# EAGLE design CSR8645-VFBGA275um-V3 (EAGLE 7.2.0)
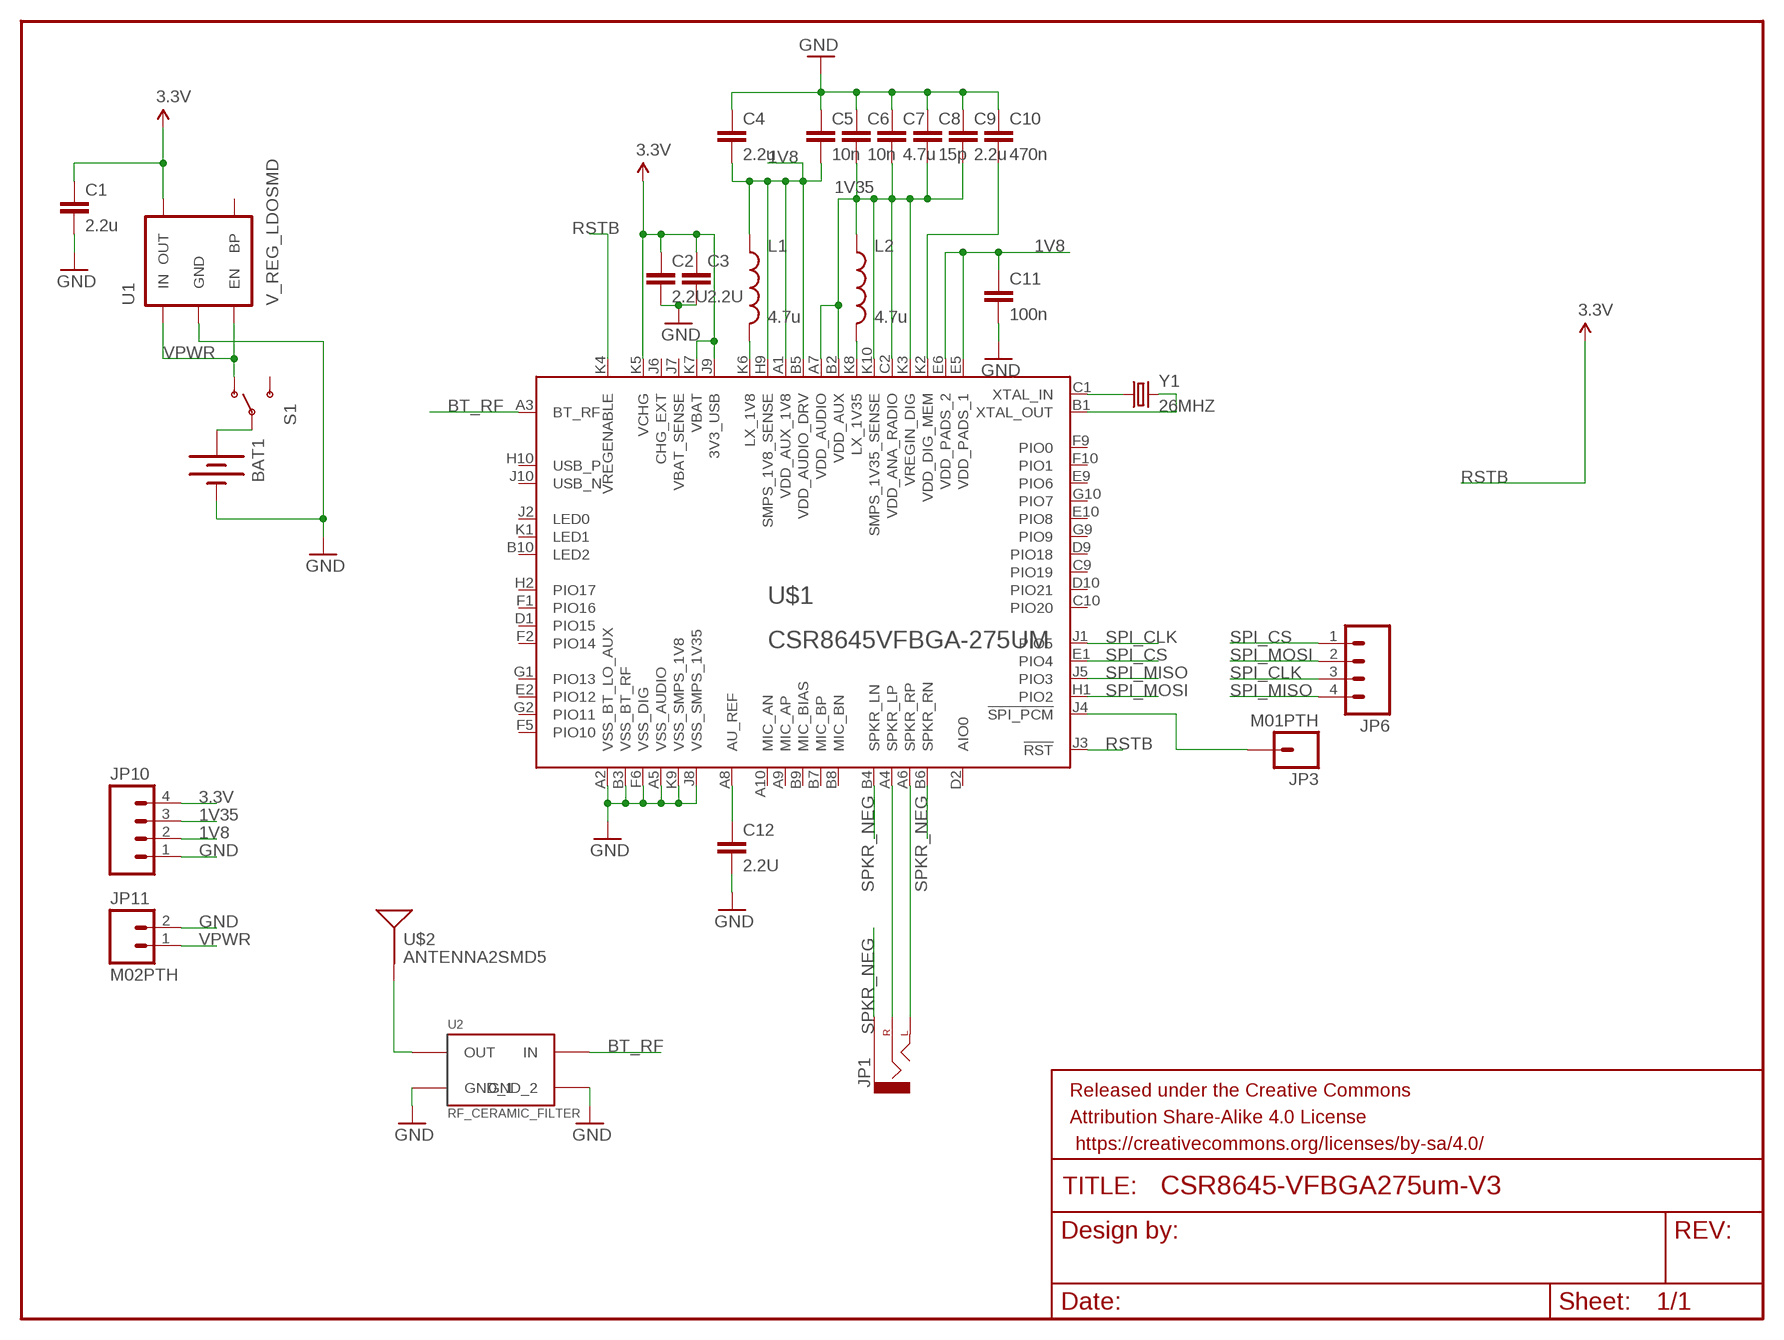
[diagram p0: schematic, sheet 1]

## Parts
BAT1  BATTERY9V  [BATTCON_9V]
C1  2.2u  CAP0603-CAP  [0603-CAP]
C2  2.2U  CAP0603-CAP  [0603-CAP]
C3  2.2U  CAP0603-CAP  [0603-CAP]
C4  2.2u  CAP0603-CAP  [0603-CAP]
C5  10n  CAP0603-CAP  [0603-CAP]
C6  10n  CAP0603-CAP  [0603-CAP]
C7  4.7u  CAP0603-CAP  [0603-CAP]
C8  15p  CAP0603-CAP  [0603-CAP]
C9  2.2u  CAP0603-CAP  [0603-CAP]
C10  470n  CAP0603-CAP  [0603-CAP]
C11  100n  CAP0603-CAP  [0603-CAP]
C12  2.2U  CAP0603-CAP  [0603-CAP]
FRAME1  FRAME-LETTER  [CREATIVE_COMMONS]
JP1  AUDIO-JACKSMD2  [AUDIO-JACK-3.5MM-SMD]
JP3  M01PTH  [1X01]
JP6  M04PTH  [1X04]
JP10  M04PTH  [1X04]
JP11  M02PTH  [1X02]
L1  4.7u  INDUCTOR0805  [0805]
L2  4.7u  INDUCTOR0805  [0805]
S1  SWITCH-SPDTPTH  [SWITCH-SPDT]
U1  V_REG_LDOSMD  [SOT23-5]
U2  RF_CERAMIC_FILTER  [RF_FILTER]
U$1  CSR8645VFBGA-275UM  [VFBGA68-LARGE]
U$2  ANTENNA2SMD5  [ANTENNA-CHIP5]
Y1  26MHZ  CRYSTALHC49US  [HC49US]

## Nets
1V8: C4.2 C5.2 C11.1 JP10.2 L1.1 U$1.A1(VDD_AUX_1V8) U$1.B5(VDD_AUDIO_DRV) U$1.E5(VDD_PADS_1) U$1.E6(VDD_PADS_2) U$1.H9(SMPS_1V8_SENSE)
1V35: C6.2 C7.2 C8.2 C9.2 JP10.3 L2.1 U$1.A7(VDD_AUDIO) U$1.B2(VDD_AUX) U$1.C2(VDD_ANA_RADIO) U$1.K3(VREGIN_DIG) U$1.K10(SMPS_1V35_SENSE)
3.3V: C1.1 C2.1 C3.1 JP10.4 U1.5(OUT) U$1.J9(3V3_USB) U$1.K5(VCHG) U$1.K7(VBAT)
!SPI_PCM: JP3.1 U$1.J4(!SPI_PCM)
BT_RF: U2.3(IN) U$1.A3(BT_RF)
GND: BAT1.- C1.2 C2.2 C3.2 C4.1 C5.1 C6.1 C7.1 C8.1 C9.1 C10.1 C11.2 C12.2 JP10.1 JP11.2 U1.2(GND) U2.2(GND_1) U2.4(GND_2) U$1.A2(VSS_BT_LO_AUX) U$1.A5(VSS_AUDIO) U$1.B3(VSS_BT_RF) U$1.F6(VSS_DIG) U$1.J8(VSS_SMPS_1V35) U$1.K9(VSS_SMPS_1V8)
N$1: BAT1.+ S1.2(P)
N$2: JP1.RING(RIGHT) U$1.A4(SPKR_LP)
N$3: L1.2 U$1.K6(LX_1V8)
N$4: L2.2 U$1.K8(LX_1V35)
N$5: U$1.C1(XTAL_IN) Y1.1
N$6: C10.2 U$1.K2(VDD_DIG_MEM)
N$7: U$1.B1(XTAL_OUT) Y1.2
N$8: JP1.TIP(LEFT) U$1.A6(SPKR_RP)
N$13: U2.1(OUT) U$2.FEED(SIGNAL)
N$15: C12.1 U$1.A8(AU_REF)
RSTB: U$1.J3(!RST) U$1.K4(VREGENABLE) ; supply symbol labelled 3.3V
SPI_CLK: JP6.3 U$1.J1(PIO5)
SPI_CS: JP6.1 U$1.E1(PIO4)
SPI_MISO: JP6.4 U$1.J5(PIO3)
SPI_MOSI: JP6.2 U$1.H1(PIO2)
SPKR_NEG: JP1.SLEEVE U$1.B4(SPKR_LN) U$1.B6(SPKR_RN)
VPWR: JP11.1 S1.1(O) U1.1(IN) U1.3(EN)
Unconnected: S1.3(S) U1.4(BP) U$1.A9(MIC_AP) U$1.A10(MIC_AN) U$1.B7(MIC_BP) U$1.B8(MIC_BN) U$1.B9(MIC_BIAS) U$1.B10(LED2) U$1.C9(PIO19) U$1.C10(PIO20) U$1.D1(PIO15) U$1.D2(AIO0) U$1.D9(PIO18) U$1.D10(PIO21) U$1.E2(PIO12) U$1.E9(PIO6) U$1.E10(PIO8) U$1.F1(PIO16) U$1.F2(PIO14) U$1.F5(PIO10) U$1.F9(PIO0) U$1.F10(PIO1) U$1.G1(PIO13) U$1.G2(PIO11) U$1.G9(PIO9) U$1.G10(PIO7) U$1.H2(PIO17) U$1.H10(USB_P) U$1.J2(LED0) U$1.J6(CHG_EXT) U$1.J7(VBAT_SENSE) U$1.J10(USB_N) U$1.K1(LED1)

## Library data of the parts
BAT1 = SparkFun-Electromechanical:BATTERY: Battery Holders Various common sizes : AA, AAA, 18650 (PRT-12895), 20mm coin cell and 12mm coin cell. 20MM_4LEGS, BATT-10373
C1-C12 = SparkFun-Passives:CAP: Capacitor Standard 0603 ceramic capacitor, and 0.1" leaded capacitor.
FRAME1 = SparkFun-Aesthetics:FRAME-LETTER: Schematic Frame Standard 8.5x11 US Letter frame
JP1 = SparkFun-Connectors:AUDIO-JACK: 3.5mm Audio Jack Simple 3.5mm common PCB mount audio jack. SKU: PRT-08032; PROD_ID: CONN-10353
JP3 = SparkFun-Connectors:M01: Header 1 Standard 1-pin 0.1" header. Use with straight break away headers (SKU : PRT-00116), right angle break away headers (PRT-00553), swiss pins (PRT-00743), machine pins (PRT-00117), and female headers (PRT-00115).
JP6 JP10 = SparkFun-Connectors:M04: Header 4 Standard 4-pin 0.1" header. Use with straight break away headers (SKU : PRT-00116), right angle break away headers (PRT-00553), swiss pins (PRT-00743), machine pins (PRT-00117), and female headers (PRT-00115). Molex polarized connector foot print use with SKU : PRT-08231 with associated crimp pins and housings. 1MM SMD Version SKU: PRT-10208
JP11 = SparkFun-Connectors:M02: Standard 2-pin 0.1" header. Use with - straight break away headers ( PRT-00116) - right angle break away headers (PRT-00553) - swiss pins (PRT-00743) - machine pins (PRT-00117) - female headers (PRT-00115) Molex polarized connector foot print use with: PRT-08233 with associated crimp pins and housings. 2.54_SCREWTERM for use with PRT-10571. 3.5mm Screw Terminal footprints for PRT-08084 5mm Screw Terminal footprints for use with PRT-08432
L1 L2 = SparkFun-Passives:INDUCTOR: Inductors Basic Inductor/Choke - 0603 and 1206. Footprints are not proven and vary greatly between part numbers. SRN6045- 33uH, 20% 1.4A SDR0403-560KL - 56uH, 10%, 500mA RMS/740mA peak
S1 = SparkFun-Electromechanical:SWITCH-SPDT: SPDT Switch Simple slide switch, Spark Fun Electronics SKU : COM-00102 DPDT SMT slide switch, AYZ0202, SWCH-08179; PROD_ID: SWCH-08261
U1 = SparkFun-PowerIC:V_REG_LDO: Voltage Regulator LDO Standard 150mA LDO voltage regulator in SOT-23 layout. Micrel part MIC5205. BP (by-pass) pin is used to lower output noise with 470pF cap.
U2 = SparkFun-RF:RF_CERAMIC_FILTER
U$1 = SparkFun-DigitalIC:CSR8645
U$2 = SparkFun-RF:ANTENNA2: Chip antenna Single endded antenna. Common with smaller chip antennas. CHIP4 package is the GPS Chip Antenna SKU: GPS-08418. CHIP5 package is 2.4GHz chip antenna SKU: WRL-00144.
Y1 = SparkFun-FreqCtrl:CRYSTAL: Various standard crystals. Proven footprints.

## Board
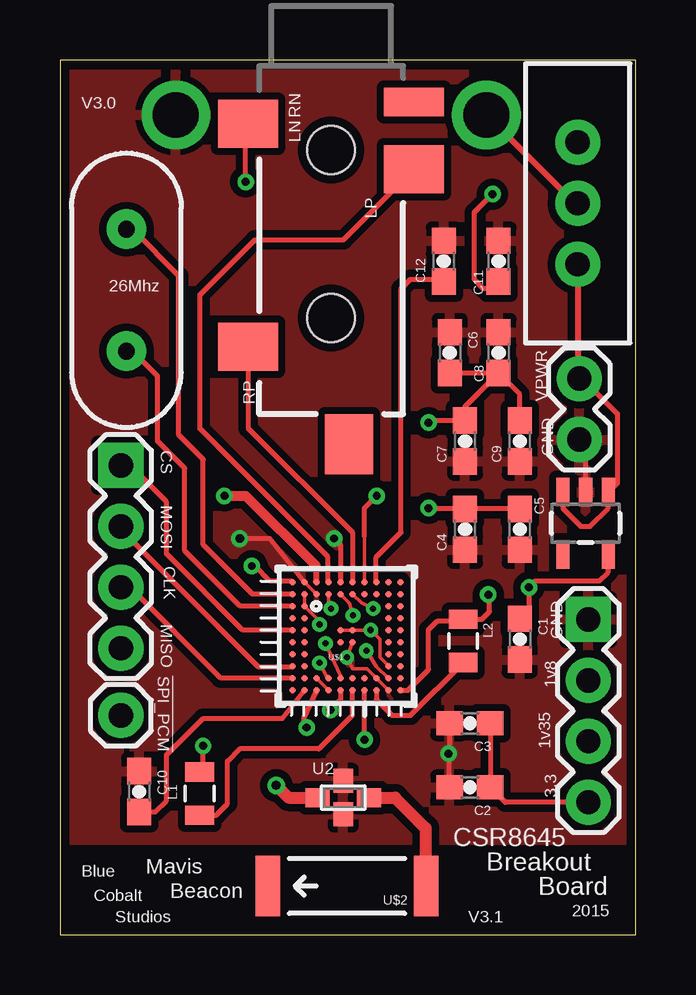
[diagram p1: board, top side]
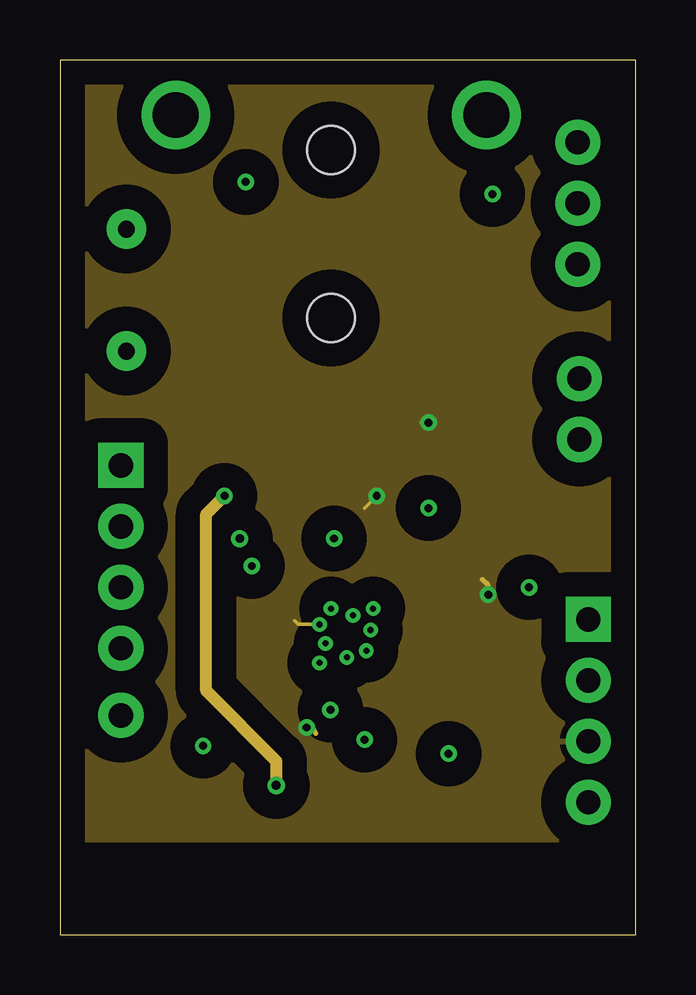
[diagram p2: board, inner layer Route2]
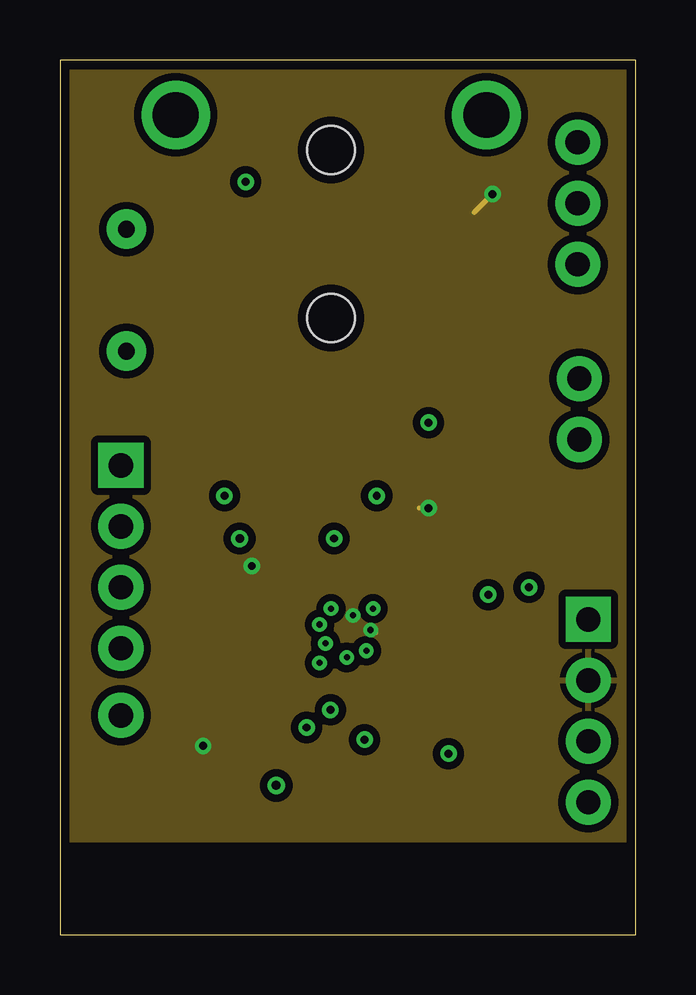
[diagram p3: board, inner layer Route15]
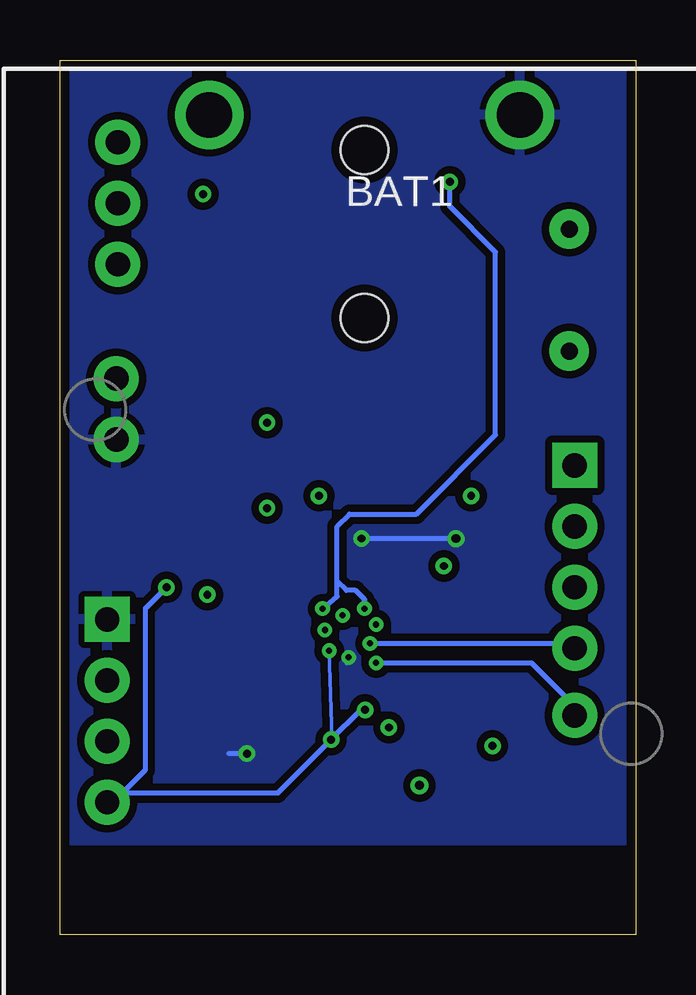
[diagram p4: board, bottom side, seen from below]

Size 24 x 36.45 mm. Coordinates in mm from the lower left corner, seen from the top.
Outline: 0,0 24,0 24,36.45 0,36.45 0,0
Copper layers (1*2*15*16): Top 0.035559375mm / dielectric 0.17018125mm / Route2 0.01778125mm / dielectric 47mil / Route15 0.01778125mm / dielectric 0.17018125mm / Bottom 0.035559375mm
Design rules "OSHPark-4layer *": minimum track width 5mil, minimum drill 10mil, track to track 5mil, track to pad 5mil, pad to pad 5mil, via to via 5mil, smd to smd 5mil, copper to edge 15mil, drill to drill 6mil, minimum pad ring 4mil, minimum via ring 7mil, stop-mask expansion 4mil, vias tented up to drill 20mil, thermal gap 10mil

### Footprints (pad centres in the part's own frame; a part is rotated, then mirrored left to right if it is on the bottom)
BATTCON_9V = drill 1.905: + 0,0; - 0,-12.954
0603-CAP = smd 1.1 x 1: 1 -0.85,0; 2 0.85,0
AUDIO-JACK-3.5MM-SMD = smd 2 x 2.5: RING 4.3,3.45; SLEEVE 2.4,-3.45; TIP 11.7,-3.45 | smd 1.2 x 2.5: RSH 1.5,3.45 | smd 2.5 x 2: TSH 15.75,0.75 | hole 2: 3.5,0; 10.5,0
1X01 = drill 1.016 pad 1.88: 1 0,0
1X04 = drill 1.016 pad 1.88 square: 1 0,0 | drill 1.016 pad 1.88: 2 2.54,0; 3 5.08,0; 4 7.62,0
1X02 = drill 1.016 pad 1.88: 1 0,0; 2 2.54,0
0805 = smd 0.8 x 1.2: 1 -0.9,0; 2 0.9,0
SWITCH-SPDT = drill 1.016 pad 1.88: 1 0,2.54; 2 0,0; 3 0,-2.54
SOT23-5 = smd 0.55 x 1.2: 1 -0.95,-1.3; 2 0,-1.3; 3 0.95,-1.3; 4 0.95,1.3; 5 -0.95,1.3
RF_FILTER = smd 1 x 0.8: 1 1.075,0; 3 -1.075,0 | smd 0.8 x 1: 2 0,0.7; 4 0,-0.7
VFBGA68-LARGE = smd 0.275 x 0.275: A1 -2.25,2.25; A2 -1.75,2.25; A3 -1.25,2.25; A4 -0.75,2.25; A5 -0.25,2.25; A6 0.25,2.25; A7 0.75,2.25; A8 1.25,2.25; A9 1.75,2.25; A10 2.25,2.25; B1 -2.25,1.75; B2 -1.75,1.75; B3 -1.25,1.75; B4 -0.75,1.75; B5 -0.25,1.75; B6 0.25,1.75; B7 0.75,1.75; B8 1.25,1.75; B9 1.75,1.75; B10 2.25,1.75; C1 -2.25,1.25; C2 -1.75,1.25; C9 1.75,1.25; C10 2.25,1.25; D1 -2.25,0.75; D2 -1.75,0.75; D9 1.75,0.75; D10 2.25,0.75; E1 -2.25,0.25; E2 -1.75,0.25; E5 -0.25,0.25; E6 0.25,0.25; E9 1.75,0.25; E10 2.25,0.25; F1 -2.25,-0.25; F2 -1.75,-0.25; F5 -0.25,-0.25; F6 0.25,-0.25; F9 1.75,-0.25; F10 2.25,-0.25; G1 -2.25,-0.75; G2 -1.75,-0.75; G9 1.75,-0.75; G10 2.25,-0.75; H1 -2.25,-1.25; H2 -1.75,-1.25; H9 1.75,-1.25; H10 2.25,-1.25; J1 -2.25,-1.75; J2 -1.75,-1.75; J3 -1.25,-1.75; J4 -0.75,-1.75; J5 -0.25,-1.75; J6 0.25,-1.75; J7 0.75,-1.75; J8 1.25,-1.75; J9 1.75,-1.75; J10 2.25,-1.75; K1 -2.25,-2.25; K2 -1.75,-2.25; K3 -1.25,-2.25; K4 -0.75,-2.25; K5 -0.25,-2.25; K6 0.25,-2.25; K7 0.75,-2.25; K8 1.25,-2.25; K9 1.75,-2.25; K10 2.25,-2.25
ANTENNA-CHIP5 = smd 1.016 x 2.54: FEED -3.302,0; NC 3.302,0
HC49US = drill 0.7 pad 1.651: 1 -2.54,0; 2 2.54,0

### Placement (x,y rotation side)
BAT1  17.78,34.16 90 bottom
C1  19.18,12.32 270 top
C2  17.09,6.15 180 top
C3  17.09,8.81 180 top
C4  16.89,16.89 90 top
C5  19.18,16.89 90 top
C6  16.26,24.26 270 top
C7  16.89,20.57 90 top
C8  18.29,24.26 270 top
C9  19.18,20.57 90 top
C10  3.3,5.97 270 top
C11  18.29,28.07 90 top
C12  16,28.07 90 top
FRAME1  116.59,78.49 0 top  (outside the outline)
JP1  11.3,36.2 270 top
JP3  2.54,9.14 0 top
JP6  2.54,19.56 270 top
JP10  22.03,13.14 270 top
JP11  21.65,23.17 270 top
L1  5.82,5.88 270 top
L2  16.81,12.24 270 top
S1  21.59,30.48 180 top
U1  21.92,17.15 180 top
U2  11.81,5.71 0 top
U$1  11.94,12.45 0 top
U$2  11.97,2.03 180 top
Y1  2.77,26.86 90 top

### Tracks (layer width: path | path; a pad name or v marks a point on that pad's centre or on a via)
1V8  (via drill 0.25, 0.33)
  Top 0.152: U$1.H9 13.34,11.56 13.34,12.32 v12.95,12.7 | U$1.E6 | U$1.E6 U$1.E5 | 13.21,12.57 13.08,12.7 v12.95,12.7 | U$1.E6 v12.95,12.7 | U$1.B5 12.07,13.82 v12.22,13.31
  Top 0.203: v15.37,17.78 15.41,17.74 C4.2 C5.2 | L1.1 5.97,6.93 v5.97,7.87 | U$1.A1 9.65,14.73 8.76,14.73 8.13,15.37 v8,15.37 | C11.1 18.29,27.05 18.16,26.92 17.65,26.92 17.27,27.3 17.27,30.1 v18.03,30.86
  Route15 0.152: v12.95,12.7 13.08,12.7 13.21,12.57
  Route15 0.203: v15.37,17.78 14.99,17.78 | v18.03,30.86 17.27,30.1
  pour Route15 (isolate 0.305): 0,36.45 23.88,36.45 24,3.94 0,3.94
1V35  (via drill 0.25, 0.33)
  Top 0.152: U$1.B2 U$1.C2 | U$1.C2 | U$1.A7 12.69,16.62 | v10.82,12.93 10.82,13.06 U$1.C2
  Top 0.203: C8.2 16.89,22.01 C7.2 15.45,21.42 v15.37,21.34 | U$1.K3 10.16,9.02 10.16,8.64 v10.29,8.64 | U$1.K10 14.53,10.2 14.53,10.21 15.37,11.05 15.37,12.7 15.75,13.08 16.75,13.08 L2.1 17.59,13.14 17.91,13.46 17.91,14.12 v17.86,14.17 | 12.69,16.62 12.69,17.77 v13.21,18.29 | C9.2 19.18,22.52 C8.2 | C8.2 C6.2
  Route2 0.152: v13.21,18.29 12.7,17.78 | v10.82,12.93 9.93,12.93 9.78,13.08
  Route2 0.203: v15.37,21.34 15.11,21.34 | v10.29,8.64 10.54,8.64 10.67,8.38 | v17.86,14.17 17.86,14.55 17.6,14.81
  pour Route2 (isolate 1.016): 0,36.45 23.88,36.45 23.88,3.94 0,3.94
3.3V  (via drill 0.25, 0.33)
  Top 0.152: U$1.J9 13.21,11.18 v12.78,11.84
  Top 0.203: 17.94,8.52 18.24,8.81 C3.1 17.94,8.52 | 17.94,8.52 C2.1 18.57,5.52 JP10.4 | v12.7,8.13 12.7,10.18 U$1.K7 | U$1.K5 11.69,9.78 v11.28,9.37 | U1.5 22.86,15.83 22.86,15.11 22.48,14.73 19.81,14.73 v19.56,14.48 19.56,13.55 C1.1
  Bottom 0.152: 12.65,8.18 v12.78,11.84
  Bottom 0.203: v11.28,9.37 11.56,9.27 12.65,8.18 v12.7,8.13 14.93,5.9 21.4,5.9 | JP10.4 21.65,5.9 21.4,5.9 | 21.4,5.9 20.45,6.86 20.45,13.59 v19.56,14.48
!SPI_PCM  (via drill 0.25)
  Top 0.152: U$1.J4 11.15,10.7 v10.82,11.33
  Bottom 0.203: v10.82,11.33 4.34,11.33 2.54,9.53 JP3.1
BT_RF  (via drill 0.33, 0.38)
  Top 0.254: 10.67,15.37 10.67,14.72 U$1.A3
  Top 0.406: v6.86,18.29 7.75,18.29 10.67,15.37
  Top 0.508: v9.02,6.22 9.53,5.71 U2.3
  Route2 0.508: v6.86,18.29 6.1,17.53 6.1,10.16 9.02,7.24 v9.02,6.22
GND  (via drill 0.25, 0.33, 0.36)
  Top 0.152: U$1.K9 U$1.J8 12.81,11.07 12.19,11.07 v11.96,11.56 U$1.F6 | U$1.B3 U$1.A2
  Top 0.203: C2.2 16.24,7.51 v16.2,7.54 16.24,7.58 C3.2 | U$1.A2 8.76,16.51 v7.49,16.51 | v11.43,16.51 11.69,16.25 U$1.A5 | U1.2 21.92,20.37 JP11.2
  Bottom 0.152: v11.96,11.56 12.07,11.3
  Bottom 0.203: v16.2,7.54 16.97,7.54 | v7.49,16.51 v11.43,16.51
  pour Top (isolate 0.305): 0,36.45 24,36.45 24,3.94 0,3.94
  pour Bottom (isolate 0.305): 0,36.45 24,36.45 24,3.94 0,3.94
N$1
  Top 0.254: S1.2 21.46,30.48 BAT1.+
N$2
  Top 0.203: U$1.A4 11.18,14.71 11.18,15.75 5.84,21.08 5.84,26.67 8.13,28.96 11.81,28.96 JP1.RING
N$3
  Top 0.203: L1.2 6.5,4.98 6.98,5.46 6.98,7.24 7.49,7.75 10.79,7.75 12.19,9.14 U$1.K6
N$4
  Top 0.203: U$1.K8 13.19,9.8 13.84,9.14 14.62,9.14 L2.2 16.77,11.3
N$5
  Top 0.203: U$1.C1 7.51,13.7 5.21,16 5.21,19.43 4.06,20.57 4.06,23.28 3.02,24.32 Y1.1
N$6
  Top 0.203: C10.2 3.98,5.12 4.45,5.59 4.45,7.49 5.97,9.02 9.27,9.02 U$1.K2 10.16,10.17
N$7
  Top 0.203: U$1.B1 8.03,14.2 5.97,16.26 5.97,19.81 4.95,20.83 4.95,27.47 3.02,29.4 Y1.2
N$8
  Top 0.203: JP1.TIP 7.85,21.1 12.19,16.76 U$1.A6
N$13
  Top 0.508: U$2.FEED 15.24,2.06 15.24,4.45 13.97,5.71 U2.1
N$15
  Top 0.203: U$1.A8 13.18,15.72 14.22,16.76 14.22,26.92 14.61,27.3 15.91,27.3 C12.1
RSTB
  Top 0.152: U$1.K4 U$1.J3
SPI_CLK
  Top 0.203: U$1.J1 6.7,10.7 2.92,14.48 JP6.3
SPI_CS
  Top 0.203: U$1.E1 7.62,12.7 4.45,15.87 4.45,18.03 2.92,19.56 JP6.1
SPI_MISO  (via drill 0.25)
  Top 0.152: U$1.J5 11.69,10.79 v11.07,12.14 11.23,11.99
  Bottom 0.203: v11.07,12.14 2.72,12.14 2.54,11.96 JP6.4
SPI_MOSI
  Top 0.203: U$1.H1 9.67,11.18 8.26,11.18 2.54,16.89 JP6.2
SPKR_NEG  (via drill 0.25, 0.33)
  Top 0.152: U$1.B6 12.57,13.84 v13.06,13.59 | U$1.B4 11.19,13.7 v11.3,13.59
  Top 0.203: v7.75,31.37 7.75,33.02 7.85,33.13 JP1.SLEEVE
  Bottom 0.203: v7.75,31.37 7.75,30.35 5.84,28.45 5.84,20.83 9.14,17.53 11.94,17.53 12.45,17.02 12.45,14.73 | v13.06,13.59 12.45,14.1 12.45,14.73 | v11.3,13.59 11.3,13.97 11.68,14.35 12.07,14.35 12.45,14.73
VPWR
  Top 0.203: U1.3 20.97,17.77 21.72,17.02 22.1,17.02 22.86,17.78 U1.1 23.24,18.82 23.24,21.72 21.78,23.18 JP11.1
  Top 0.254: S1.1 21.59,23.24 JP11.1

### Text on the board
tPlace: V3.0 | RN | LN | LP | 26Mhz | RP | VPWR | CS | GND | MOSI | CLK | MISO | GND | !SPI_PCM | 1v8 | 1v35 | 3.3 | CSR8645 | Blue | Mavis | Breakout | Cobalt | Beacon | Board | Studios | V3.1 | 2015